# Altium schematic sheet PowerConversion.SchDoc
size A; SheetNumber: 1; SheetTotal: 1
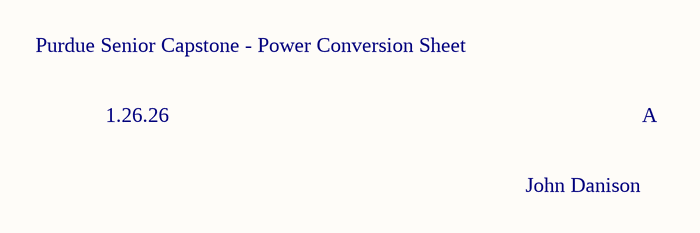
[diagram p0: PowerConversion.SchDoc]

## Notes on the sheet
- Purdue Senior Capstone - Power Conversion Sheet
- 1.26.26
- A
- John Danison